# EAGLE design SGP30 Breakout (EAGLE 9.3.0)
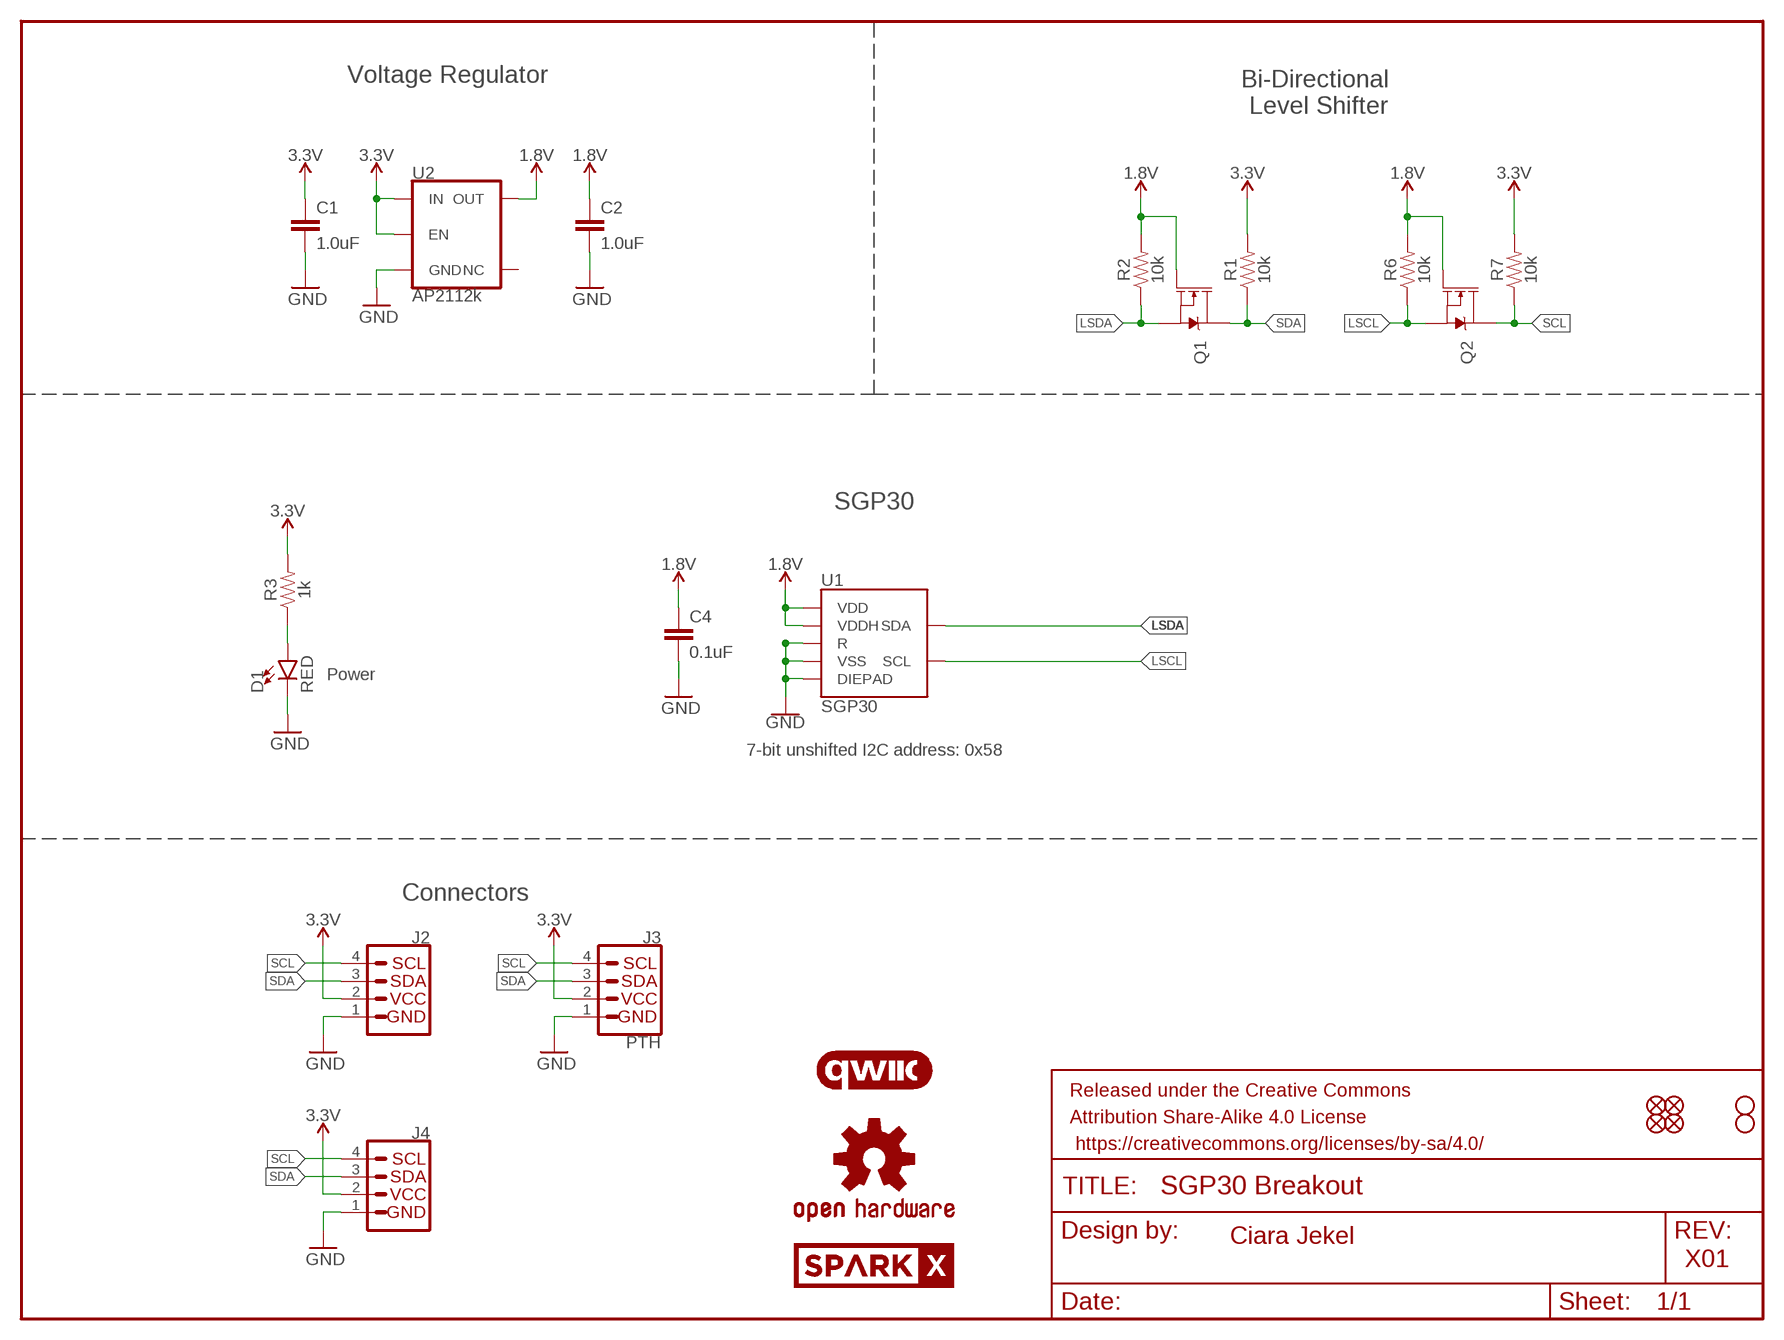
[diagram p0: schematic, sheet 1]

## Parts
C1  1.0uF  1.0UF-0603-16V-10%  [0603]
C2  1.0uF  1.0UF-0603-16V-10%  [0603]
C4  0.1uF  0.1UF-0603-25V-(+80/-20%)  [0603]
D1  RED  LED-RED0603  [LED-0603]
FRAME1  FRAME-LETTER  [CREATIVE_COMMONS]
J2  QWIIC_CONNECTORJS-1MM  [1X04_1MM_RA]
J3  PTH  I2C_STANDARD_NO_SILK  [1X04_NO_SILK]
J4  QWIIC_CONNECTORJS-1MM  [1X04_1MM_RA]
JP1  FIDUCIALUFIDUCIAL  [MICRO-FIDUCIAL]
JP2  FIDUCIALUFIDUCIAL  [MICRO-FIDUCIAL]
JP3  STAND-OFF  [STAND-OFF]
JP4  STAND-OFF  [STAND-OFF]
JP5  FIDUCIALUFIDUCIAL  [MICRO-FIDUCIAL]
JP6  FIDUCIALUFIDUCIAL  [MICRO-FIDUCIAL]
LOGO1  OSHW-LOGOMINI  [OSHW-LOGO-MINI]
Q1  MOSFET-NCH-BSS138  [SOT23-3]
Q2  MOSFET-NCH-BSS138  [SOT23-3]
R1  10k  10KOHM-0603-1/10W-1%  [0603]
R2  10k  10KOHM-0603-1/10W-1%  [0603]
R3  1k  1KOHM-0603-1/10W-1%  [0603]
R6  10k  10KOHM-0603-1/10W-1%  [0603]
R7  10k  10KOHM-0603-1/10W-1%  [0603]
U1  SGP30  [SGP30]
U2  AP2112k  MIC5504  [SOT23-5]
U$1  SPARKX-LOGO4  [SPARKX-MEDIUM]
U$2  SPARKX-LOGO4  [SPARKX-MEDIUM]
U$9  QWIIC_LOGO_7MM  [QWIIC_7MM]

## Nets
1.8V: C2.1 C4.1 Q1.1(G) Q2.1(G) R2.2 R6.2 U1.1(VDD) U1.5(VDDH) U2.5(OUT)
3.3V: C1.1 J2.2 J3.2(VCC) J4.2 R1.2 R3.2 R7.2 U2.1(IN) U2.3(EN)
GND: C1.2 C2.2 C4.2 D1.C J2.1 J3.1(GND) J4.1 U1.2(VSS) U1.4(R) U1.DIEPAD U2.2(GND)
LSCL: Q2.2(S) R6.1 U1.6(SCL)
LSDA: Q1.2(S) R2.1 U1.3(SDA)
N$3: D1.A R3.1
SCL: J2.4 J3.4(SCL) J4.4 Q2.3(D) R7.1
SDA: J2.3 J3.3(SDA) J4.3 Q1.3(D) R1.1
Unconnected: U2.4(NC)

## Notes on the sheet
- Voltage Regulator
- Bi-Directional 
  Level Shifter
- SGP30
- Power
- 7-bit unshifted I2C address: 0x58
- Connectors
- Ciara Jekel
- X01

## Library data of the parts
C1 C2 = SparkFun-Capacitors:1.0UF: 1µF ceramic capacitors A capacitor is a passive two-terminal electrical component used to store electrical energy temporarily in an electric field.; PROD_ID: CAP-00868
C4 = SparkFun-Capacitors:0.1UF: 0.1µF ceramic capacitors A capacitor is a passive two-terminal electrical component used to store electrical energy temporarily in an electric field.; PROD_ID: CAP-00810
D1 = SparkFun-LED:LED-RED: Red SMD LED Used in manufacturing of most products at SparkFun Packages: 0603 - SMD 0603 package [Product Link] <http://docs.avagotech.com/docs/AV02-0551EN> 0603 SMART - SMD 0603 SMART package ( more efficient and expensive)[Product Link] <http://www.osram-os.com/Graphics/XPic2/00077099_0.pdf> 1206 - SMD1206 package [Product Link] <https://www.sparkfun.com/datasheets/DevTools/LilyPad/Q150OVS4.pdff> SparkFun Products: Pro Mini 328 -5V <https://www.sparkfun.com/products/821> RedBoard <https://www.sparkfun.com/products/12757> IOIO-OTG <https://www.sparkfun.com/products/13613>; PROD_ID: DIO-00819
FRAME1 = SparkFun-Aesthetics:FRAME-LETTER: Schematic Frame - Letter Standard 8.5x11 US Letter frame
J2 J4 = SparkFun-Connectors:QWIIC_CONNECTOR: SparkFun I2C Standard Qwiic Connector An SMD 1mm pitch JST connector makes it easy and quick (get it? Qwiic?) to connect I2C devices to each other. The Qwiic system <http://www.sparkfun.com/qwiic> enables fast and solderless connection between popular platforms and various sensors and actuators. We carry 200mm <https://www.sparkfun.com/products/14204>, 100mm <https://www.sparkfun.com/products/14205>, 50mm <https://www.sparkfun.com/products/14206>, and breadboard friendly <https://www.sparkfun.com/products/14207> Qwiic cables. We also offer 10 pcs strips <https://www.sparkfun.com/products/14323> the SMD connectors.; PROD_ID: CONN-13694
J3 = SparkX:I2C_STANDARD: SparkFun I2C Standard Pinout Header SparkFun has standardized on a pinout for all I2C based sensor breakouts. This pinout allows I2C boards to be plugged directly into the headers on Arduino Uno compatible boards, and to be daisy chained easily. Example SparkFun Products: SparkFun Atmospheric Sensor Breakout - BME280 <https://www.sparkfun.com/products/13676> SparkFun Altitude/Pressure Sensor Breakout - MPL3115A2 <https://www.sparkfun.com/products/11084> SparkFun TOF Range Finder Sensor - VL6180 <https://www.sparkfun.com/products/12785>
JP1 JP2 JP5 JP6 = SparkFun:FIDUCIAL: Fiducial Alignment Points Various fiducial points for machine vision alignment.
JP3 JP4 = SparkFun:STAND-OFF: Stand Off This is the mechanical footprint for a #4 phillips button head screw. Use the keepout ring to avoid running the screw head into surrounding components. SKU : PRT-00447
LOGO1 = SparkFun-Aesthetics:OSHW-LOGO: Open-Source Hardware (OSHW) Logo This logo indicates the piece of hardware it is found on incorporates a OSHW license and/or adheres to the definition of open source hardware found here: http://freedomdefined.org/OSHW
Q1 Q2 = SparkFun-DiscreteSemi:MOSFET-NCH: N-channel MOSFETs Voltage controlled devices that allow control of high current outputs. SparkFun Products: SparkFun OpenScale <https://www.sparkfun.com/products/13261> SparkFun Digital Sandbox <https://www.sparkfun.com/products/12651> SparkFun Monster Moto Shield <https://www.sparkfun.com/products/10182> SparkFun MOSFET Power Controller <https://www.sparkfun.com/products/11214>; PROD_ID: TRANS-00830; VALUE: 220mA/50V/3.5Ω
R1 R2 R6 R7 = SparkFun-Resistors:10KOHM: 10kΩ resistor A resistor is a passive two-terminal electrical component that implements electrical resistance as a circuit element. Resistors act to reduce current flow, and, at the same time, act to lower voltage levels within circuits. - Wikipedia; PROD_ID: RES-00824
R3 = SparkFun-Resistors:1KOHM: 1kΩ resistor A resistor is a passive two-terminal electrical component that implements electrical resistance as a circuit element. Resistors act to reduce current flow, and, at the same time, act to lower voltage levels within circuits. - Wikipedia; PROD_ID: RES-07856
U1 = SGP30:SGP30
U2 = SGP30:MIC5504
U$1 U$2 = SparkX:SPARKX-LOGO
U$9 = SparkFun-Aesthetics:QWIIC_LOGO: Qwiic Logos for placement on schematic and PCB. The 5.5mm silk logo is best for placing next to Qwiic connector.

## Net classes
1 power: width 0.203 mm

## Board
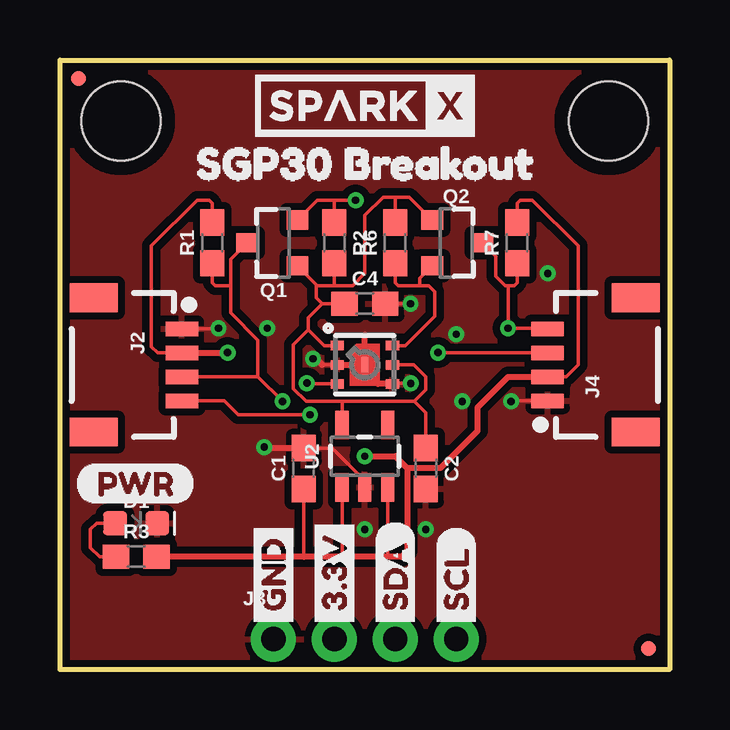
[diagram p1: board, top side]
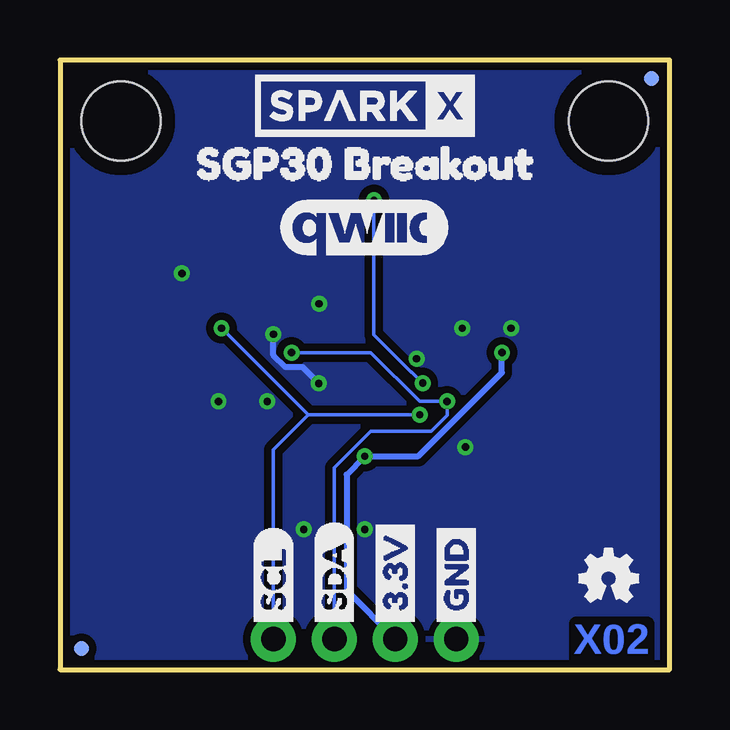
[diagram p2: board, bottom side, seen from below]

Size 25.4 x 25.4 mm. Coordinates in mm from the lower left corner, seen from the top.
Outline: 0,0 0,25.4 25.4,25.4 25.4,0 0,0
Copper layers (1*16): Top 0.035mm / dielectric 1.5mm / Bottom 0.035mm
Design rules "SparkFun-2-layer-PCBWay-LIMIT": minimum track width 6mil, minimum drill 0.3mm, track to track 6mil, track to pad 6mil, pad to pad 6mil, via to via 6mil, smd to smd 6mil, copper to edge 6mil, drill to drill 6mil, minimum pad ring 7mil, minimum via ring 7mil, stop-mask expansion 4mil, vias tented up to drill 25mil, thermal gap 10mil

### Footprints (pad centres in the part's own frame; a part is rotated, then mirrored left to right if it is on the bottom)
0603 = smd 1.1 x 1: 1 -0.85,0; 2 0.85,0
LED-0603 = smd 1 x 1: A -0.877,0; C 0.877,0
1X04_1MM_RA = smd 0.6 x 1.35: 1 -1.5,0; 2 -0.5,0; 3 0.5,0; 4 1.5,0 | smd 1.2 x 2: NC1 2.8,-3.675; NC2 -2.8,-3.675
1X04_NO_SILK = drill 1.016 pad 1.88: 1 0,0; 2 2.54,0; 3 5.08,0; 4 7.62,0
MICRO-FIDUCIAL = smd 0.635 x 0.635: 1 0,0
STAND-OFF = hole 3.302: 0,0
SOT23-3 = smd 0.8 x 0.9: 1 -0.95,-1; 2 0.95,-1; 3 0,1.1
SGP30 = smd 0.55 x 0.4: 1 -1.15,0.8; 2 -1.15,0; 3 -1.15,-0.8; 4 1.15,-0.8; 5 1.15,0; 6 1.15,0.8 | smd 0.305 x 0.61: DIEPAD 0,0
SOT23-5 = smd 0.55 x 1.2: 1 -0.95,-1.3; 2 0,-1.3; 3 0.95,-1.3; 4 0.95,1.3; 5 -0.95,1.3

### Placement (x,y rotation side)
C1  10.16,8.38 90 top
C2  15.24,8.38 270 top
C4  12.7,15.24 0 top
D1  3.17,6.1 0 top
FRAME1  -12.7,-12.7 0 top  (outside the outline)
J2  5.08,12.7 270 top
J3  8.89,1.27 0 top
J4  20.32,12.7 90 top
JP1  0.76,24.64 0 bottom
JP2  24.51,0.89 0 top
JP3  2.54,22.86 0 top
JP4  22.86,22.86 0 top
JP5  24.51,0.89 0 bottom
JP6  0.76,24.64 0 top
LOGO1  2.54,3.81 0 bottom
Q1  8.89,17.78 90 top
Q2  16.51,17.78 270 top
R1  6.35,17.78 90 top
R2  11.43,17.78 270 top
R3  3.17,4.7 0 top
R6  13.97,17.78 90 top
R7  19.05,17.78 90 top
U1  12.7,12.7 0 top
U2  12.7,8.89 0 top
U$1  12.7,23.5 0 top
U$2  12.7,23.5 0 bottom
U$3  [GND1]  8.89,1.52 90 bottom
U$4  [3#3V2]  11.43,1.52 90 bottom
U$5  [SDA8]  13.97,1.52 90 bottom
U$6  [SCL9]  16.51,1.52 90 bottom
U$7  [SGP30_BREAKOUT1]  4.57,21.08 0 top
U$8  [SGP30_BREAKOUT1]  20.83,21.08 0 bottom
U$9  12.7,18.41 0 bottom
U$10  [(PWR)]  0.64,7.75 0 top
U$21  [3#3V2]  11.43,1.52 90 top
U$22  [GND1]  8.89,1.52 90 top
U$26  [SCL9]  16.51,1.52 90 top
U$27  [SDA8]  13.97,1.52 90 top

### Tracks (layer width: path | path; a pad name or v marks a point on that pad's centre or on a via)
1.8V
  Top 0.152: 10.92,15.24 C4.1 | U1.5 14.73,12.7 15.24,12.19 15.24,11.66 14.76,11.18 | 10.35,14.16 11.01,13.5 U1.1 | 10.35,14.16 9.73,13.54 9.73,11.71 10.26,11.18 11.75,11.18 | 14.76,11.18 11.75,11.18 | U2.5 11.75,11.18 | 10.35,14.16 10.35,14.67 10.92,15.24 | 10.92,15.24 10.67,15.49 10.67,16 10.72,16 | 13.97,19.68 13.46,19.68 12.7,18.92 12.7,16.51 12.19,16 11.43,16 | R2.2 11.43,16 | R6.2 13.97,19.68 | C2.1 15.24,10.7 14.76,11.18 | Q2.1 14.55,19.68 13.97,19.68 | Q1.1 10.72,16 | 10.72,16 11.43,16
3.3V  (via drill 0.3)
  Top 0.152: 20.19,12.2 J4.2 21.09,12.2 21.59,12.7 21.59,17.65 19.68,19.56 19.18,19.56 19.05,19.43 R7.2 | R1.2 6.35,19.43 6.22,19.56 5.71,19.56 3.81,17.65 3.81,13.46 4.07,13.2 J2.2 | C1.1 10.16,4.7 | U2.1 11.75,4.76 11.81,4.7 | 13.59,4.7 13.65,4.76 U2.3
  Top 0.254: J2.2 v6.99,13.21 | v12.7,8.89 13.97,8.89 14.46,8.4 | 20.19,12.2 18.67,12.2 17.4,10.93 17.4,9.95 15.86,8.4 14.46,8.4 | R3.2 10.16,4.7 11.81,4.7 13.59,4.7 14.22,4.7 14.46,4.94 14.46,8.4
  Bottom 0.254: v6.99,13.21 6.99,12.37 10.47,8.89 v12.7,8.89 13.46,8.13 13.46,3.3 J3.2
GND  (via drill 0.3)
  Top 0.152: 10.92,12.7 U1.2 12.45,12.7 | C4.2 v14.61,15.24 | J2.1 6.58,14.2 v6.6,14.22 | J4.1 18.82,11.2 v18.8,11.18 | U1.4 13.88,11.93 v14.62,11.93 | 12.45,12.7 12.57,12.7 | 13.21,11.94 12.45,12.7 | U2.2 12.7,7.87 11.34,9.23 C1.2
  Top 0.254: v10.54,12.95 10.67,12.95 10.92,12.7 | C1.2 8.55,9.23 v8.51,9.27 | U1.2 12.57,12.7 | 12.57,12.7 U1.DIEPAD 12.7,13.97 | U1.4 13.25,11.9 13.21,11.94 12.57,12.57 12.57,12.7
  Bottom 0.254: v14.62,11.93 15.29,12.6 16,12.6 16.51,13.11 v16.51,13.97
  other vias: 8.64,14.22 15.24,5.84 16.76,11.18 20.32,16.51 12.7,5.84
  pour Bottom (isolate 0.305): 0,0 0,25.4 25.4,25.4 25.4,0
  pour Top (isolate 0.305): 0,0 0,25.4 25.4,25.4 25.4,0
LSCL
  Top 0.152: U1.6 14.39,13.5 15.62,14.73 15.62,15.75 15.37,16 14.99,16 | R6.1 13.97,16.13 14.1,16 14.99,16 | Q2.2 14.99,16.31 14.99,16
LSDA  (via drill 0.3)
  Top 0.152: 11.43,19.56 v12.32,19.56 | R2.1 11.43,19.56 | U1.3 10.32,11.9 v10.29,11.94 | Q1.2 10.72,19.56 11.43,19.56
  Bottom 0.152: v10.29,11.94 10.74,12.39 10.77,12.39 12.32,13.94 v12.32,19.56
N$3
  Top 0.152: R3.1 1.65,4.7 1.27,5.08 1.27,5.84 1.52,6.1 D1.A
SCL  (via drill 0.3)
  Top 0.152: J4.4 20.3,14.22 v18.67,14.22 18.67,16 | v10.41,10.62 7.42,10.62 6.83,11.2 J2.4 | Q2.3 18.16,17.23 18.16,16.38 18.54,16 18.67,16 | 18.67,16 18.92,16 19.05,16.13 R7.1
  Bottom 0.152: v18.67,14.22 15.06,10.62 | 15.06,10.62 v10.41,10.62 | J3.4 16.51,9.17 15.06,10.62
SDA  (via drill 0.3)
  Top 0.152: J4.3 v15.76,13.2 v15.75,13.21 | v9.27,11.18 8.25,12.2 | 8.25,12.2 J2.3 | 8.25,12.2 8.25,13.72 7.11,14.86 7.11,16 | R1.1 6.35,16.13 6.48,16 7.11,16 | Q1.3 7.11,17.1 7.11,16
  Bottom 0.152: v15.75,13.21 12.45,13.21 10.41,11.18 v9.27,11.18 9.27,10.59 9.93,9.93 12.45,9.93 13.97,8.41 J3.3

### Text on the board
Bottom: X02
Measures: Dimensions in inches
tDocu: Ciara Jekel